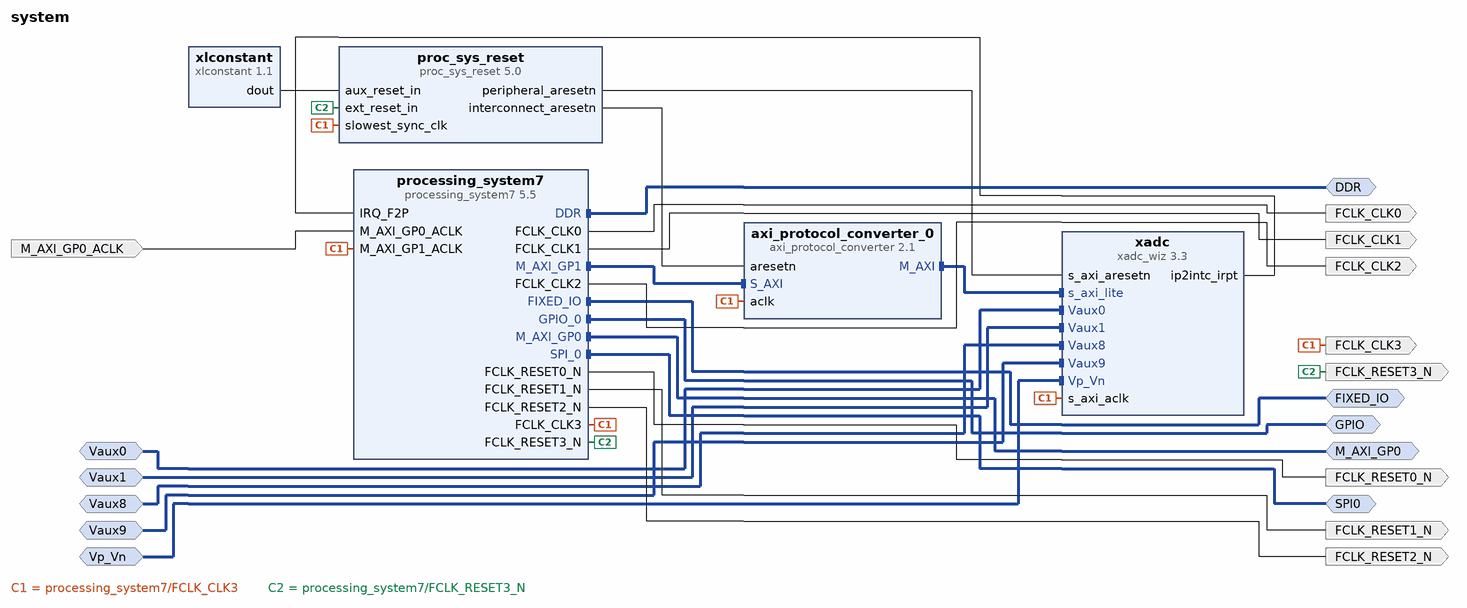
[diagram p0: block diagram of the top level]
# Vivado block design system, xc7z010clg400-1, Vivado 2018.2
create_bd_design system

create_bd_intf_port -mode Master -vlnv xilinx.com:interface:ddrx_rtl:1.0 DDR
create_bd_intf_port -mode Master -vlnv xilinx.com:display_processing_system7:fixedio_rtl:1.0 FIXED_IO
create_bd_intf_port -mode Master -vlnv xilinx.com:interface:gpio_rtl:1.0 GPIO
create_bd_intf_port -mode Master -vlnv xilinx.com:interface:aximm_rtl:1.0 M_AXI_GP0
set_property -dict [list \
  CONFIG.DATA_WIDTH 32 \
  CONFIG.PROTOCOL AXI3 \
  CONFIG.FREQ_HZ 125000000 \
  CONFIG.ADDR_WIDTH 32 \
] [get_bd_intf_ports M_AXI_GP0]
create_bd_intf_port -mode Master -vlnv xilinx.com:interface:spi_rtl:1.0 SPI0
create_bd_intf_port -mode Slave -vlnv xilinx.com:interface:diff_analog_io_rtl:1.0 Vaux0
create_bd_intf_port -mode Slave -vlnv xilinx.com:interface:diff_analog_io_rtl:1.0 Vaux1
create_bd_intf_port -mode Slave -vlnv xilinx.com:interface:diff_analog_io_rtl:1.0 Vaux8
create_bd_intf_port -mode Slave -vlnv xilinx.com:interface:diff_analog_io_rtl:1.0 Vaux9
create_bd_intf_port -mode Slave -vlnv xilinx.com:interface:diff_analog_io_rtl:1.0 Vp_Vn
create_bd_port -dir O -type clk FCLK_CLK0
create_bd_port -dir O -type clk FCLK_CLK1
create_bd_port -dir O -type clk FCLK_CLK2
create_bd_port -dir O -type clk FCLK_CLK3
create_bd_port -dir O -type rst FCLK_RESET0_N
create_bd_port -dir O -type rst FCLK_RESET1_N
create_bd_port -dir O -type rst FCLK_RESET2_N
create_bd_port -dir O -type rst FCLK_RESET3_N
create_bd_port -dir I -type clk M_AXI_GP0_ACLK
set_property -dict {CONFIG.FREQ_HZ 125000000 CONFIG.ASSOCIATED_BUSIF M_AXI_GP0} [get_bd_ports M_AXI_GP0_ACLK]

create_bd_cell -type ip -vlnv xilinx.com:ip:axi_protocol_converter:2.1 axi_protocol_converter_0
create_bd_cell -type ip -vlnv xilinx.com:ip:proc_sys_reset:5.0 proc_sys_reset
set_property -dict {CONFIG.C_EXT_RST_WIDTH 1} [get_bd_cells proc_sys_reset]
create_bd_cell -type ip -vlnv xilinx.com:ip:processing_system7:5.5 processing_system7
set_property -dict [list \
  CONFIG.PCW_FCLK_CLK1_BUF TRUE \
  CONFIG.PCW_FCLK_CLK2_BUF TRUE \
  CONFIG.PCW_FCLK_CLK3_BUF TRUE \
  CONFIG.PCW_QSPI_PERIPHERAL_FREQMHZ 125 \
  CONFIG.PCW_SDIO_PERIPHERAL_FREQMHZ 100 \
  CONFIG.PCW_UART_PERIPHERAL_FREQMHZ 100 \
  CONFIG.PCW_SPI_PERIPHERAL_FREQMHZ 200 \
  CONFIG.PCW_I2C_PERIPHERAL_FREQMHZ 111.111115 \
  CONFIG.PCW_FPGA0_PERIPHERAL_FREQMHZ 125 \
  CONFIG.PCW_FPGA1_PERIPHERAL_FREQMHZ 250 \
  CONFIG.PCW_FPGA3_PERIPHERAL_FREQMHZ 200 \
  CONFIG.PCW_USE_M_AXI_GP1 1 \
  CONFIG.PCW_USE_FABRIC_INTERRUPT 1 \
  CONFIG.PCW_GPIO_EMIO_GPIO_WIDTH 24 \
  CONFIG.PCW_EN_CLK1_PORT 1 \
  CONFIG.PCW_EN_CLK2_PORT 1 \
  CONFIG.PCW_EN_CLK3_PORT 1 \
  CONFIG.PCW_EN_RST1_PORT 1 \
  CONFIG.PCW_EN_RST2_PORT 1 \
  CONFIG.PCW_EN_RST3_PORT 1 \
  CONFIG.PCW_IRQ_F2P_INTR 1 \
  CONFIG.PCW_PRESET_BANK1_VOLTAGE {LVCMOS 2.5V} \
  CONFIG.PCW_UIPARAM_DDR_BUS_WIDTH {16 Bit} \
  CONFIG.PCW_UIPARAM_DDR_PARTNO {MT41J256M16 RE-125} \
  CONFIG.PCW_QSPI_PERIPHERAL_ENABLE 1 \
  CONFIG.PCW_QSPI_QSPI_IO {MIO 1 .. 6} \
  CONFIG.PCW_QSPI_GRP_SINGLE_SS_ENABLE 1 \
  CONFIG.PCW_QSPI_GRP_SINGLE_SS_IO {MIO 1 .. 6} \
  CONFIG.PCW_SINGLE_QSPI_DATA_MODE x4 \
  CONFIG.PCW_ENET0_PERIPHERAL_ENABLE 1 \
  CONFIG.PCW_ENET0_ENET0_IO {MIO 16 .. 27} \
  CONFIG.PCW_ENET0_GRP_MDIO_ENABLE 1 \
  CONFIG.PCW_ENET0_GRP_MDIO_IO {MIO 52 .. 53} \
  CONFIG.PCW_ENET_RESET_ENABLE 1 \
  CONFIG.PCW_ENET_RESET_SELECT {Share reset pin} \
  CONFIG.PCW_ENET0_RESET_ENABLE 0 \
  CONFIG.PCW_SD0_PERIPHERAL_ENABLE 1 \
  CONFIG.PCW_SD0_SD0_IO {MIO 40 .. 45} \
  CONFIG.PCW_SD0_GRP_CD_ENABLE 1 \
  CONFIG.PCW_SD0_GRP_CD_IO {MIO 46} \
  CONFIG.PCW_SD0_GRP_WP_ENABLE 1 \
  CONFIG.PCW_SD0_GRP_WP_IO {MIO 47} \
  CONFIG.PCW_UART0_PERIPHERAL_ENABLE 1 \
  CONFIG.PCW_UART0_UART0_IO {MIO 14 .. 15} \
  CONFIG.PCW_UART1_PERIPHERAL_ENABLE 1 \
  CONFIG.PCW_UART1_UART1_IO {MIO 8 .. 9} \
  CONFIG.PCW_SPI0_PERIPHERAL_ENABLE 1 \
  CONFIG.PCW_SPI0_SPI0_IO EMIO \
  CONFIG.PCW_SPI1_PERIPHERAL_ENABLE 1 \
  CONFIG.PCW_SPI1_SPI1_IO {MIO 10 .. 15} \
  CONFIG.PCW_TTC0_PERIPHERAL_ENABLE 1 \
  CONFIG.PCW_TTC0_TTC0_IO EMIO \
  CONFIG.PCW_USB0_PERIPHERAL_ENABLE 1 \
  CONFIG.PCW_USB0_USB0_IO {MIO 28 .. 39} \
  CONFIG.PCW_USB_RESET_ENABLE 1 \
  CONFIG.PCW_USB_RESET_SELECT {Share reset pin} \
  CONFIG.PCW_USB0_RESET_ENABLE 1 \
  CONFIG.PCW_USB0_RESET_IO {MIO 48} \
  CONFIG.PCW_I2C0_PERIPHERAL_ENABLE 1 \
  CONFIG.PCW_I2C0_I2C0_IO {MIO 50 .. 51} \
  CONFIG.PCW_I2C0_GRP_INT_ENABLE 0 \
  CONFIG.PCW_I2C_RESET_ENABLE 1 \
  CONFIG.PCW_I2C_RESET_SELECT {Share reset pin} \
  CONFIG.PCW_GPIO_MIO_GPIO_ENABLE 1 \
  CONFIG.PCW_GPIO_MIO_GPIO_IO MIO \
  CONFIG.PCW_GPIO_EMIO_GPIO_ENABLE 1 \
  CONFIG.PCW_GPIO_EMIO_GPIO_IO 24 \
  CONFIG.PCW_FPGA_FCLK1_ENABLE 1 \
  CONFIG.PCW_FPGA_FCLK2_ENABLE 1 \
  CONFIG.PCW_FPGA_FCLK3_ENABLE 1 \
] [get_bd_cells processing_system7]
# 222 more settings of processing_system7 are not shown: defaults, MIO pin electricals, DDR timing, and values the tool derives
create_bd_cell -type ip -vlnv xilinx.com:ip:xadc_wiz:3.3 xadc
set_property -dict [list \
  CONFIG.INTERFACE_SELECTION Enable_AXI \
  CONFIG.XADC_STARUP_SELECTION independent_adc \
  CONFIG.SEQUENCER_MODE Off \
  CONFIG.ENABLE_RESET false \
  CONFIG.SINGLE_CHANNEL_SELECTION TEMPERATURE \
  CONFIG.EXTERNAL_MUX_CHANNEL VP_VN \
  CONFIG.CHANNEL_ENABLE_VP_VN true \
  CONFIG.CHANNEL_ENABLE_VAUXP0_VAUXN0 true \
  CONFIG.CHANNEL_ENABLE_VAUXP1_VAUXN1 true \
  CONFIG.CHANNEL_ENABLE_VAUXP8_VAUXN8 true \
  CONFIG.CHANNEL_ENABLE_VAUXP9_VAUXN9 true \
  CONFIG.ENABLE_AXI4STREAM false \
] [get_bd_cells xadc]
create_bd_cell -type ip -vlnv xilinx.com:ip:xlconstant:1.1 xlconstant

# ---- connections ----

connect_bd_intf_net [get_bd_intf_pins axi_protocol_converter_0/M_AXI] [get_bd_intf_pins xadc/s_axi_lite]
connect_bd_intf_net -intf_net processing_system7_0_M_AXI_GP1 [get_bd_intf_pins axi_protocol_converter_0/S_AXI] [get_bd_intf_pins processing_system7/M_AXI_GP1]
connect_bd_intf_net -intf_net processing_system7_0_ddr [get_bd_intf_ports DDR] [get_bd_intf_pins processing_system7/DDR]
connect_bd_intf_net -intf_net processing_system7_0_fixed_io [get_bd_intf_ports FIXED_IO] [get_bd_intf_pins processing_system7/FIXED_IO]
connect_bd_intf_net [get_bd_intf_ports GPIO] [get_bd_intf_pins processing_system7/GPIO_0]
connect_bd_intf_net -intf_net processing_system7_0_M_AXI_GP0 [get_bd_intf_ports M_AXI_GP0] [get_bd_intf_pins processing_system7/M_AXI_GP0]
connect_bd_intf_net [get_bd_intf_ports SPI0] [get_bd_intf_pins processing_system7/SPI_0]
connect_bd_intf_net -intf_net Vaux0_1 [get_bd_intf_ports Vaux0] [get_bd_intf_pins xadc/Vaux0]
connect_bd_intf_net -intf_net Vaux1_1 [get_bd_intf_ports Vaux1] [get_bd_intf_pins xadc/Vaux1]
connect_bd_intf_net -intf_net Vaux8_1 [get_bd_intf_ports Vaux8] [get_bd_intf_pins xadc/Vaux8]
connect_bd_intf_net -intf_net Vaux9_1 [get_bd_intf_ports Vaux9] [get_bd_intf_pins xadc/Vaux9]
connect_bd_intf_net [get_bd_intf_ports Vp_Vn] [get_bd_intf_pins xadc/Vp_Vn]
connect_bd_net [get_bd_ports M_AXI_GP0_ACLK] [get_bd_pins processing_system7/M_AXI_GP0_ACLK]
connect_bd_net -net proc_sys_reset_0_interconnect_aresetn [get_bd_pins proc_sys_reset/interconnect_aresetn] \
  [get_bd_pins axi_protocol_converter_0/aresetn]
connect_bd_net -net proc_sys_reset_0_peripheral_aresetn [get_bd_pins proc_sys_reset/peripheral_aresetn] [get_bd_pins xadc/s_axi_aresetn]
connect_bd_net -net processing_system7_0_fclk_clk0 [get_bd_pins processing_system7/FCLK_CLK0] [get_bd_ports FCLK_CLK0]
connect_bd_net -net processing_system7_0_fclk_clk1 [get_bd_pins processing_system7/FCLK_CLK1] [get_bd_ports FCLK_CLK1]
connect_bd_net -net processing_system7_0_fclk_clk2 [get_bd_pins processing_system7/FCLK_CLK2] [get_bd_ports FCLK_CLK2]
connect_bd_net -net processing_system7_0_fclk_clk3 [get_bd_pins processing_system7/FCLK_CLK3] \
  [get_bd_ports FCLK_CLK3] [get_bd_pins axi_protocol_converter_0/aclk] [get_bd_pins proc_sys_reset/slowest_sync_clk] \
  [get_bd_pins processing_system7/M_AXI_GP1_ACLK] [get_bd_pins xadc/s_axi_aclk]
connect_bd_net -net processing_system7_0_fclk_reset0_n [get_bd_pins processing_system7/FCLK_RESET0_N] [get_bd_ports FCLK_RESET0_N]
connect_bd_net -net processing_system7_0_fclk_reset1_n [get_bd_pins processing_system7/FCLK_RESET1_N] [get_bd_ports FCLK_RESET1_N]
connect_bd_net -net processing_system7_0_fclk_reset2_n [get_bd_pins processing_system7/FCLK_RESET2_N] [get_bd_ports FCLK_RESET2_N]
connect_bd_net -net processing_system7_0_fclk_reset3_n [get_bd_pins processing_system7/FCLK_RESET3_N] \
  [get_bd_ports FCLK_RESET3_N] [get_bd_pins proc_sys_reset/ext_reset_in]
connect_bd_net [get_bd_pins xadc/ip2intc_irpt] [get_bd_pins processing_system7/IRQ_F2P]
connect_bd_net [get_bd_pins xlconstant/dout] [get_bd_pins proc_sys_reset/aux_reset_in]

# ---- address map ----
assign_bd_address -offset 0x40000000 -range 1G -target_address_space [get_bd_addr_spaces processing_system7/Data] [get_bd_addr_segs M_AXI_GP0/Reg]
assign_bd_address -offset 0x83C00000 -range 64K -target_address_space [get_bd_addr_spaces processing_system7/Data] [get_bd_addr_segs xadc/s_axi_lite/Reg]

validate_bd_design
save_bd_design
